# Altium schematic sheet Superbot_hbridge.SchDoc
size A4
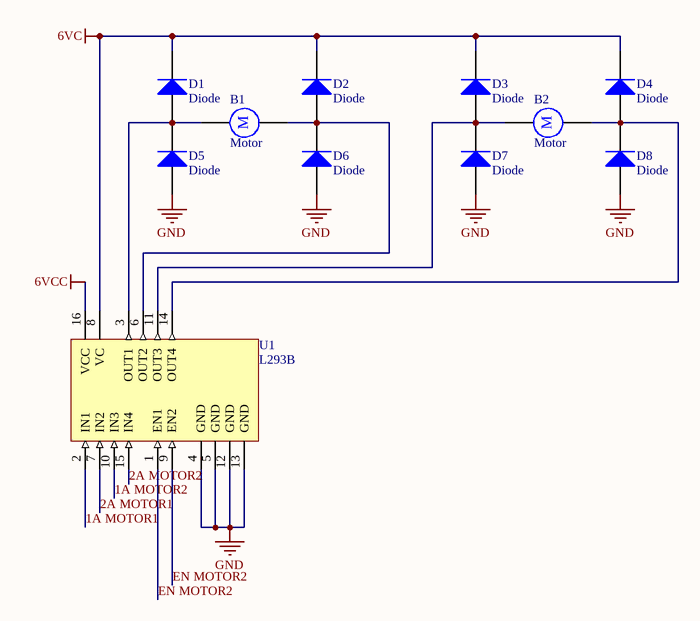
[diagram p0: Superbot_hbridge.SchDoc]

## Parts
B1  Motor  [RB5-10.5]
B2  Motor  [RB5-10.5]
D1  Diode  [SMC]
D2  Diode  [SMC]
D3  Diode  [SMC]
D4  Diode  [SMC]
D5  Diode  [SMC]
D6  Diode  [SMC]
D7  Diode  [SMC]
D8  Diode  [SMC]
U1  L293B  [DIP16]

## Nets
6VC: D1.2(K) D2.2(K) D3.2(K) D4.2(K) U1.8(VC)
6VCC: U1.16(VCC)
GND: D5.1(A) D6.1(A) D7.1(A) D8.1(A) U1.4(GND) U1.5(GND) U1.12(GND) U1.13(GND)
1A MOTOR1: U1.2(IN1)
1A MOTOR2: U1.10(IN3)
2A MOTOR1: U1.7(IN2)
2A MOTOR2: U1.15(IN4)
EN MOTOR2: U1.1(EN1) U1.9(EN2)
NetB1_1: B1.1 D1.1(A) D5.2(K) U1.3(OUT1)
NetB1_2: B1.2 D2.1(A) D6.2(K) U1.6(OUT2)
NetB2_1: B2.1 D3.1(A) D7.2(K) U1.11(OUT3)
NetB2_2: B2.2 D4.1(A) D8.2(K) U1.14(OUT4)

## Notes on the sheet
- (in symbol Motor) M

## Library data of the parts
B1 B2 = Motor: Motor, General Kind; Published: 24-Mar-1999; LatestRevisionDate: 17-Jul-2002; LatestRevisionNote: Re-released for DXP Platform.; PackageReference: RB5-10.5; Publisher: Altium Limited; PackageDescription: Capacitor (Radial); 2 Leads
D1-D8 = Diode: Default Diode; Published: 8-Jun-2000; LatestRevisionDate: 17-Jul-2002; LatestRevisionNote: Re-released for DXP Platform.; PackageVersion: Sep-1996; PackageReference: SMC; Publisher: Altium Limited; PackageDescription: DO-214-AB/SMC; 2 C-Bend Leads; Body 7.9 x 5.9 mm, inc. leads (LxW); Code_JEDEC: DO-214-AB
U1 = L293B: Push-Pull Four Channel Drivers; Published: 8-Jun-2000; LatestRevisionDate: 06-Jun-2005; LatestRevisionNote: Stylized 3D Model Added.; DatasheetVersion: Apr-1993; PackageVersion: Apr-1996; PackageReference: DIP16; Publisher: Altium Limited; PackageDescription: DIP; 16 Leads; Row Spacing 7.62 mm; Pitch 2.54 mm; ComponentLink1Description: Manufacturer Link; ComponentLink1URL: http://www.st.com/; ComponentLink2Description: Datasheet; ComponentLink2URL: http://www.st.com/stonline/products/literature/ds/1328/l293b.pdf